# EAGLE schematic untitled (EAGLE 8.0.0)
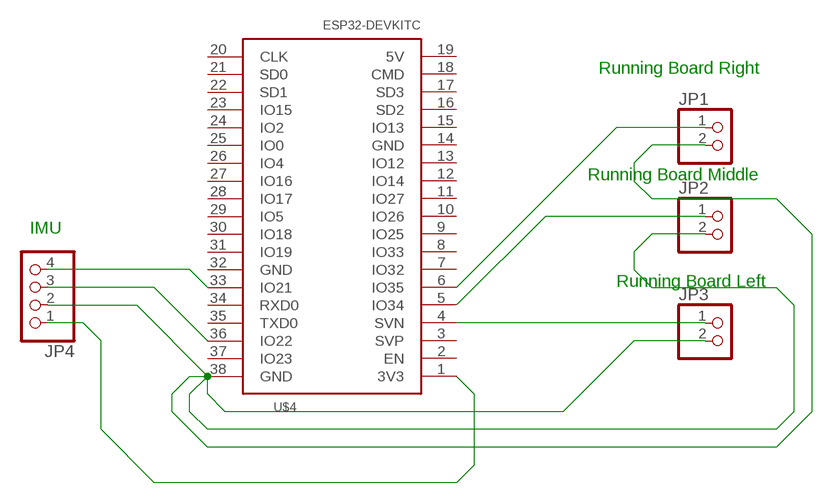
[diagram p0: schematic, sheet 1]

## Parts
JP1  PINHD-1X2  [1X02]
JP2  PINHD-1X2  [1X02]
JP3  PINHD-1X2  [1X02]
JP4  PINHD-1X4  [1X04]
U$4  ESP32DEVKITC  [ESP32-DEVKITC]

## Nets
GND: JP1.2 JP2.2 JP3.2 JP4.2 U$4.38(GND)
N$1: JP1.1 U$4.6(IO35)
N$2: JP2.1 U$4.5(IO34)
N$3: JP3.1 U$4.4(SVN)
N$5: JP4.1 U$4.1(3V3)
N$7: JP4.4 U$4.33(IO21)
N$8: JP4.3 U$4.36(IO22)
Unconnected: U$4.2(EN) U$4.3(SVP) U$4.7(IO32) U$4.8(IO33) U$4.9(IO25) U$4.10(IO26) U$4.11(IO27) U$4.12(IO14) U$4.13(IO12) U$4.14(GND) U$4.15(IO13) U$4.16(SD2) U$4.17(SD3) U$4.18(CMD) U$4.19(5V) U$4.20(CLK) U$4.21(SD0) U$4.22(SD1) U$4.23(IO15) U$4.24(IO2) U$4.25(IO0) U$4.26(IO4) U$4.27(IO16) U$4.28(IO17) U$4.29(IO5) U$4.30(IO18) U$4.31(IO19) U$4.32(GND) U$4.34(RXD0) U$4.35(TXD0) U$4.37(IO23)

## Notes on the sheet
- Running Board Right
- Running Board Middle
- IMU
- Running Board Left

## Library data of the parts
JP1-JP3 = pinhead:PINHD-1X2: PIN HEADER
JP4 = pinhead:PINHD-1X4: PIN HEADER
U$4 = ESP32-DEVKITC:ESP32DEVKITC